# Altium schematic sheet CAN-UART.SchDoc
size A
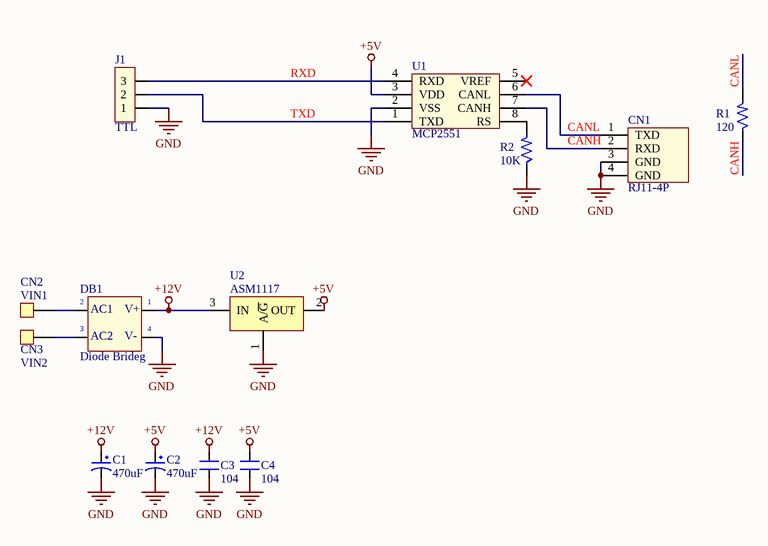
[diagram p0: CAN-UART.SchDoc]

## Parts
C1  470uF  [C-ALU-D6.5]
C2  470uF  [C-ALU-D6.5]
C3  104  [C-0805]
C4  104  [C-0805]
CN1  RJ11-4P
CN2  VIN1  [M3]
CN3  VIN2  [M3]
DB1  Diode Brideg  [D-DB-1A-SMD]
J1  TTL  [JP3]
R1  120  [R-0805]
R2  10K  [R-0805]
U1  MCP2551  [SOIC-8]
U2  ASM1117  [TO-252]

## Nets
+5V: C2.1 C4.2 U1.3(VDD) U2.2(OUT)
+12V: C1.1 C3.2 DB1.3(AC2) U2.3(IN)
GND: C1.2 C2.2 C3.1 C4.1 CN1.3(GND) CN1.4(GND) DB1.4(-V_OUT) J1.1 R2.1 U1.2(VSS) U2.1(A/~{G})
CANH: CN1.2(RXD) R1.1 U1.7(CANH)
CANL: CN1.1(TXD) R1.2 U1.6(CANL)
RXD: J1.3 U1.4(RXD)
TXD: J1.2 U1.1(TXD)
NetCN2_1: CN2.1 DB1.2(AC1)
NetCN3_1: CN3.1 DB1.1(+V_OUT)
NetR2_2: R2.2 U1.8(RS)

Not connected (* = marked no-connect by the designer): U1 5(VREF)*

## Notes on the sheet
- (in symbol DB) V+; V-

## Library data of the parts
C1 C2 = CP1: Cap P  0,1uF < 22uF , 16 - 50V; Value: 10uF/50V; Description 1: 10 => 220uF/6,3V/10V - 10uF => 100uF/16V; Description 2: 0,1uF => 33uF/50V - 10uF => 22uF/63V; Description 3: 0,47uF => 10uF/100V
C3 C4 = CN: Value: 0,1uF/300V; Designed by: VanDungEvn
CN2 CN3 = COCDONGM3: Value: M3
DB1 = DB: Convert AC to DC voltage, 4 pin; Value: Cau 1A
J1 = JP3: Jumper 3; Value: J3
R1 R2 = R: Resistor 1/4W; Value: R1/4W - 1K
CN1 = RJ11-4P: Value: RJ11-4P
U1 = MCP2551: Value: MCP2551